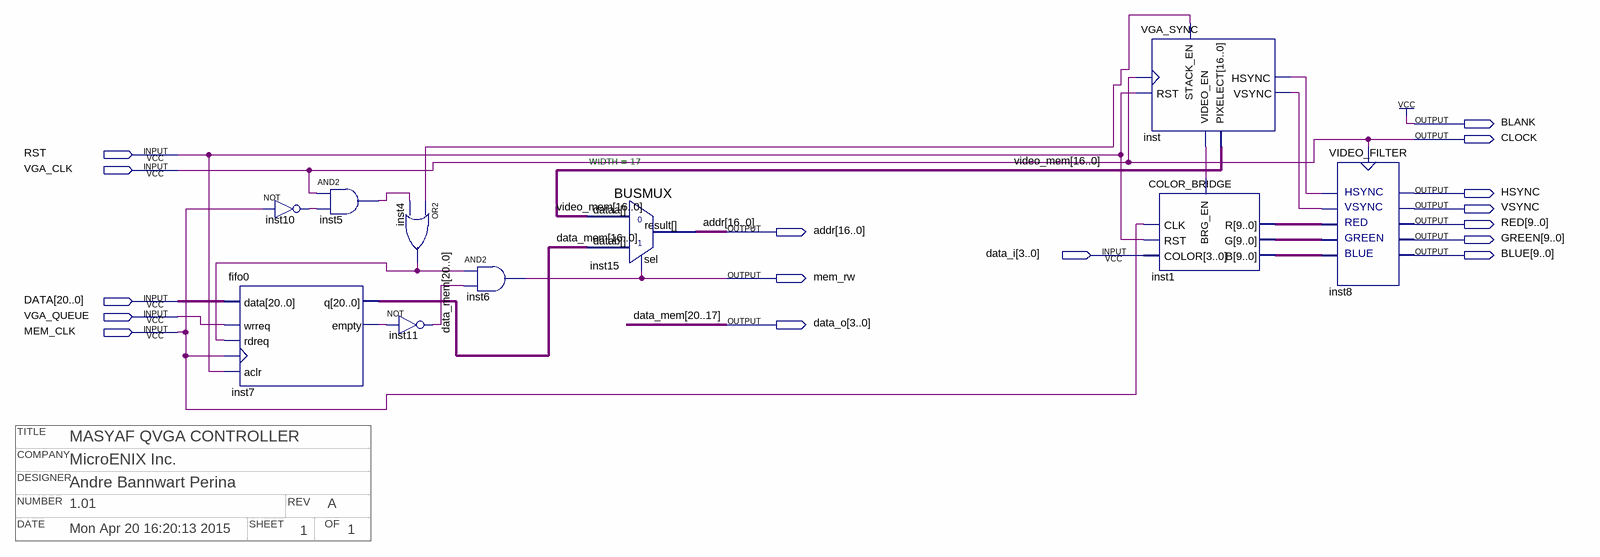
[diagram p0: schematic sheet]
// Quartus schematic VGA_MOD.bdf as structural Verilog: 10 symbols, 16 pins
// Title block: COMPANY: MicroENIX Inc.; DATE: Mon Apr 20 16:20:13 2015; DESIGNER: Andre Bannwart Perina; NUMBER: 1.01; OF: 1; REV: A; SHEET: 1; TITLE: MASYAF QVGA CONTROLLER
module VGA_MOD (
  input  RST,
  input  VGA_CLK,
  input  [3:0] data_i,
  input  [20:0] DATA,
  input  VGA_QUEUE,
  input  MEM_CLK,
  output BLANK,
  output CLOCK,
  output HSYNC,
  output VSYNC,
  output [9:0] RED,
  output [16:0] addr,
  output [9:0] GREEN,
  output [9:0] BLUE,
  output mem_rw,
  output [3:0] data_o
);

  wire inst4_out, inst5_out, inst7_empty, inst10_out, inst11_out, inst_hsync, inst_stack_en, inst_video_en,
       inst_vsync;
  wire [9:0] inst1_b, inst1_g, inst1_r;
  wire [16:0] data_mem, video_mem;

  not inst10 (inst10_out, MEM_CLK);
  fifo0 inst7 (
    .aclr(RST), .data(DATA), .rdreq(inst4_out), .wrreq(VGA_QUEUE), .clock(MEM_CLK), .empty(inst7_empty),
    .q({data_o, data_mem}));
  and inst5 (inst5_out, VGA_CLK, inst10_out);
  or inst4 (inst4_out, inst_stack_en, inst5_out);
  not inst11 (inst11_out, inst7_empty);
  and inst6 (mem_rw, inst4_out, inst11_out);
  BUSMUX #(.WIDTH(17)) inst15 (.datab(data_mem), .sel(mem_rw), .dataa(video_mem), .result(addr));
  VGA_SYNC inst (
    .RST(RST), .CLK(VGA_CLK), .PIXELECT(video_mem), .HSYNC(inst_hsync), .VSYNC(inst_vsync),
    .VIDEO_EN(inst_video_en), .STACK_EN(inst_stack_en));
  COLOR_BRIDGE inst1 (
    .CLK(MEM_CLK), .RST(RST), .BRG_EN(inst_video_en), .COLOR(data_i), .R(inst1_r), .G(inst1_g), .B(inst1_b));
  VIDEO_FILTER inst8 (
    .CLK(VGA_CLK), .iHSYNC(inst_hsync), .iVSYNC(inst_vsync), .iR(inst1_r), .iG(inst1_g), .iB(inst1_b),
    .oHSYNC(HSYNC), .oVSYNC(VSYNC), .oR(RED), .oG(GREEN), .oB(BLUE));

  assign BLANK = 1'b1;
  assign CLOCK = VGA_CLK;

  // Other names for the same wires on the sheet: data_mem[20:17] = data_o
endmodule
